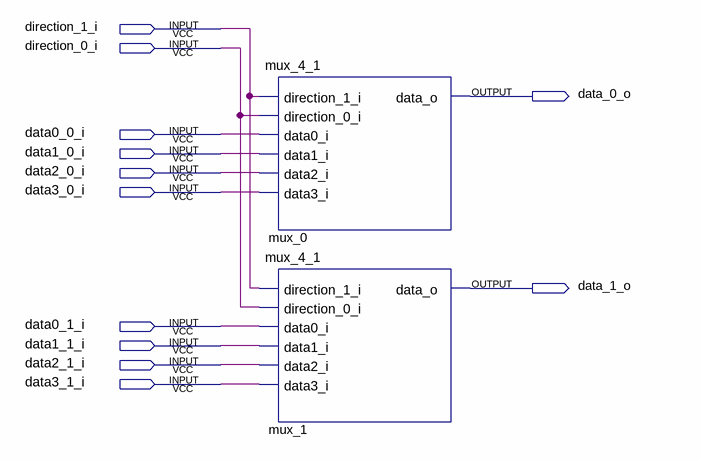
[diagram p0: schematic sheet]
// Quartus schematic mux.bdf as structural Verilog: 2 symbols, 12 pins
module mux (
  input  direction_1_i,
  input  direction_0_i,
  input  data0_0_i,
  input  data1_0_i,
  input  data2_0_i,
  input  data3_0_i,
  input  data0_1_i,
  input  data1_1_i,
  input  data2_1_i,
  input  data3_1_i,
  output data_0_o,
  output data_1_o
);

  mux_4_1 mux_0 (
    .direction_1_i(direction_1_i), .direction_0_i(direction_0_i), .data0_i(data0_0_i), .data1_i(data1_0_i),
    .data2_i(data2_0_i), .data3_i(data3_0_i), .data_o(data_0_o));
  mux_4_1 mux_1 (
    .direction_1_i(direction_1_i), .direction_0_i(direction_0_i), .data0_i(data0_1_i), .data1_i(data1_1_i),
    .data2_i(data2_1_i), .data3_i(data3_1_i), .data_o(data_1_o));
endmodule
